# Altium schematic sheet top.SchDoc
size A4; SheetNumber: 1; SheetTotal: 5
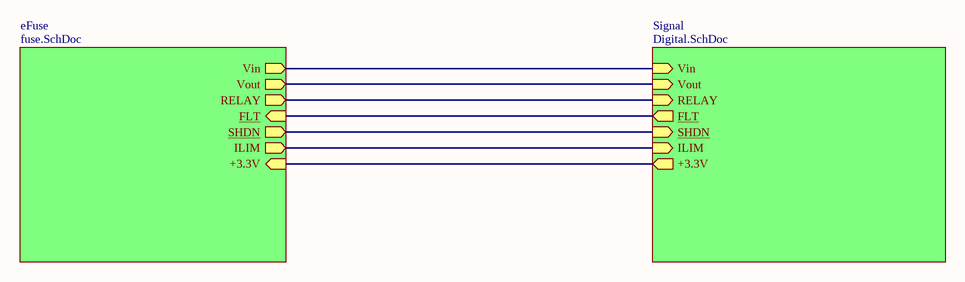
[diagram p0: top.SchDoc]

## Sub-sheets
eFuse = fuse.SchDoc: Vin (out), RELAY (out), FLT (in), SHDN (out), ILIM (out), Vout (out), +3.3V (in)
Signal = Digital.SchDoc: Vin (in), RELAY (in), FLT (out), SHDN (in), ILIM (in), Vout (in), +3.3V (out)

## Nets
(unnamed): sheet eFuse/Vin, sheet Signal/Vin
(unnamed): sheet eFuse/RELAY, sheet Signal/RELAY
(unnamed): sheet eFuse/FLT, sheet Signal/FLT
(unnamed): sheet eFuse/SHDN, sheet Signal/SHDN
(unnamed): sheet eFuse/ILIM, sheet Signal/ILIM
(unnamed): sheet eFuse/Vout, sheet Signal/Vout
(unnamed): sheet eFuse/+3.3V, sheet Signal/+3.3V